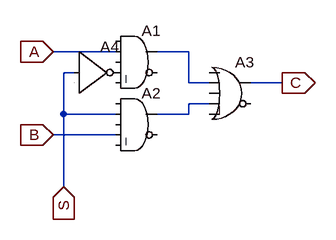
[diagram p0: schematic multiplexer.asc]
multiplexer.asc, the LTspice schematic file:
Version 4
SHEET 1 880 680
WIRE 48 112 -48 112
WIRE 160 112 112 112
WIRE -16 144 -32 144
WIRE 160 160 160 112
WIRE 192 160 160 160
WIRE 304 160 256 160
WIRE 192 192 160 192
WIRE -32 208 -32 144
WIRE 48 208 -32 208
WIRE 160 208 160 192
WIRE 160 208 112 208
WIRE 48 240 -48 240
WIRE -32 320 -32 208
FLAG -48 112 A
IOPIN -48 112 In
FLAG -48 240 B
IOPIN -48 240 In
FLAG -32 320 S
IOPIN -32 320 In
FLAG 304 160 C
IOPIN 304 160 Out
SYMBOL Digital\\and 80 64 R0
SYMATTR InstName A1
SYMBOL Digital\\and 80 160 R0
SYMATTR InstName A2
SYMBOL Digital\\or 224 112 R0
SYMATTR InstName A3
SYMBOL Digital\\inv -16 80 R0
SYMATTR InstName A4

The netlist it stands for:
* multiplexer.asc
A1 0 A 0 P001 0 0 N001 0 AND
A2 0 S 0 B 0 0 N002 0 AND
A3 0 N001 0 N002 0 0 C 0 OR
A4 S 0 0 0 0 P001 0 0 BUF
.backanno
.end